# Altium schematic sheet Main.SchDoc
size A2; ApprovedBy: Mateusz Kowalik; CheckedBy: Mateusz Kowalik; Author: Mateusz Kowalik; CompanyName: InMotion Labs sp. z o.o.; DrawnBy: Mateusz Kowalik; Engineer: Mateusz Kowalik; Organization: InMotion Labs sp. z o.o.; Address1: Rydlówka 5A; Address2: 30-363 Kraków; Address4: Poland; DocumentNumber: 1; Revision: Rev 0; SheetNumber: 1; SheetTotal: 17
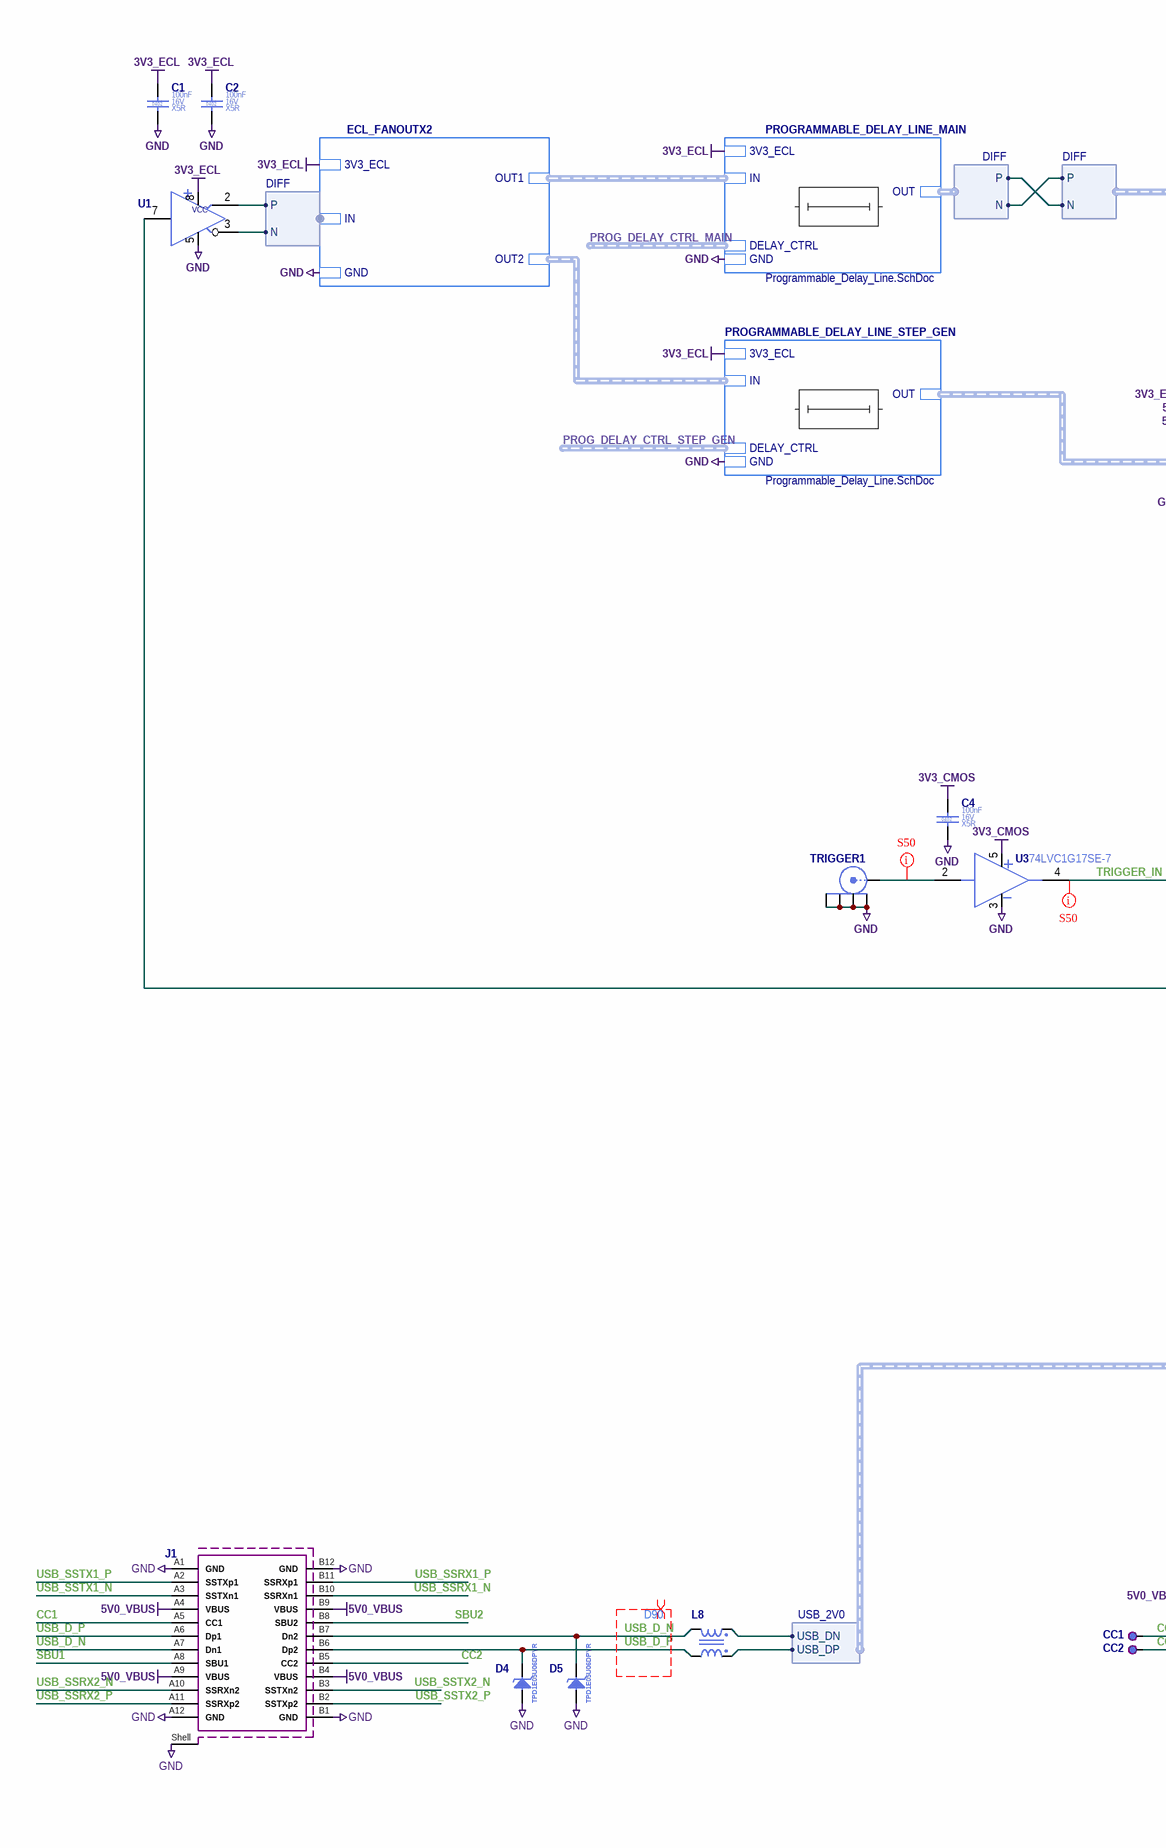
[diagram p0: Main.SchDoc, left]
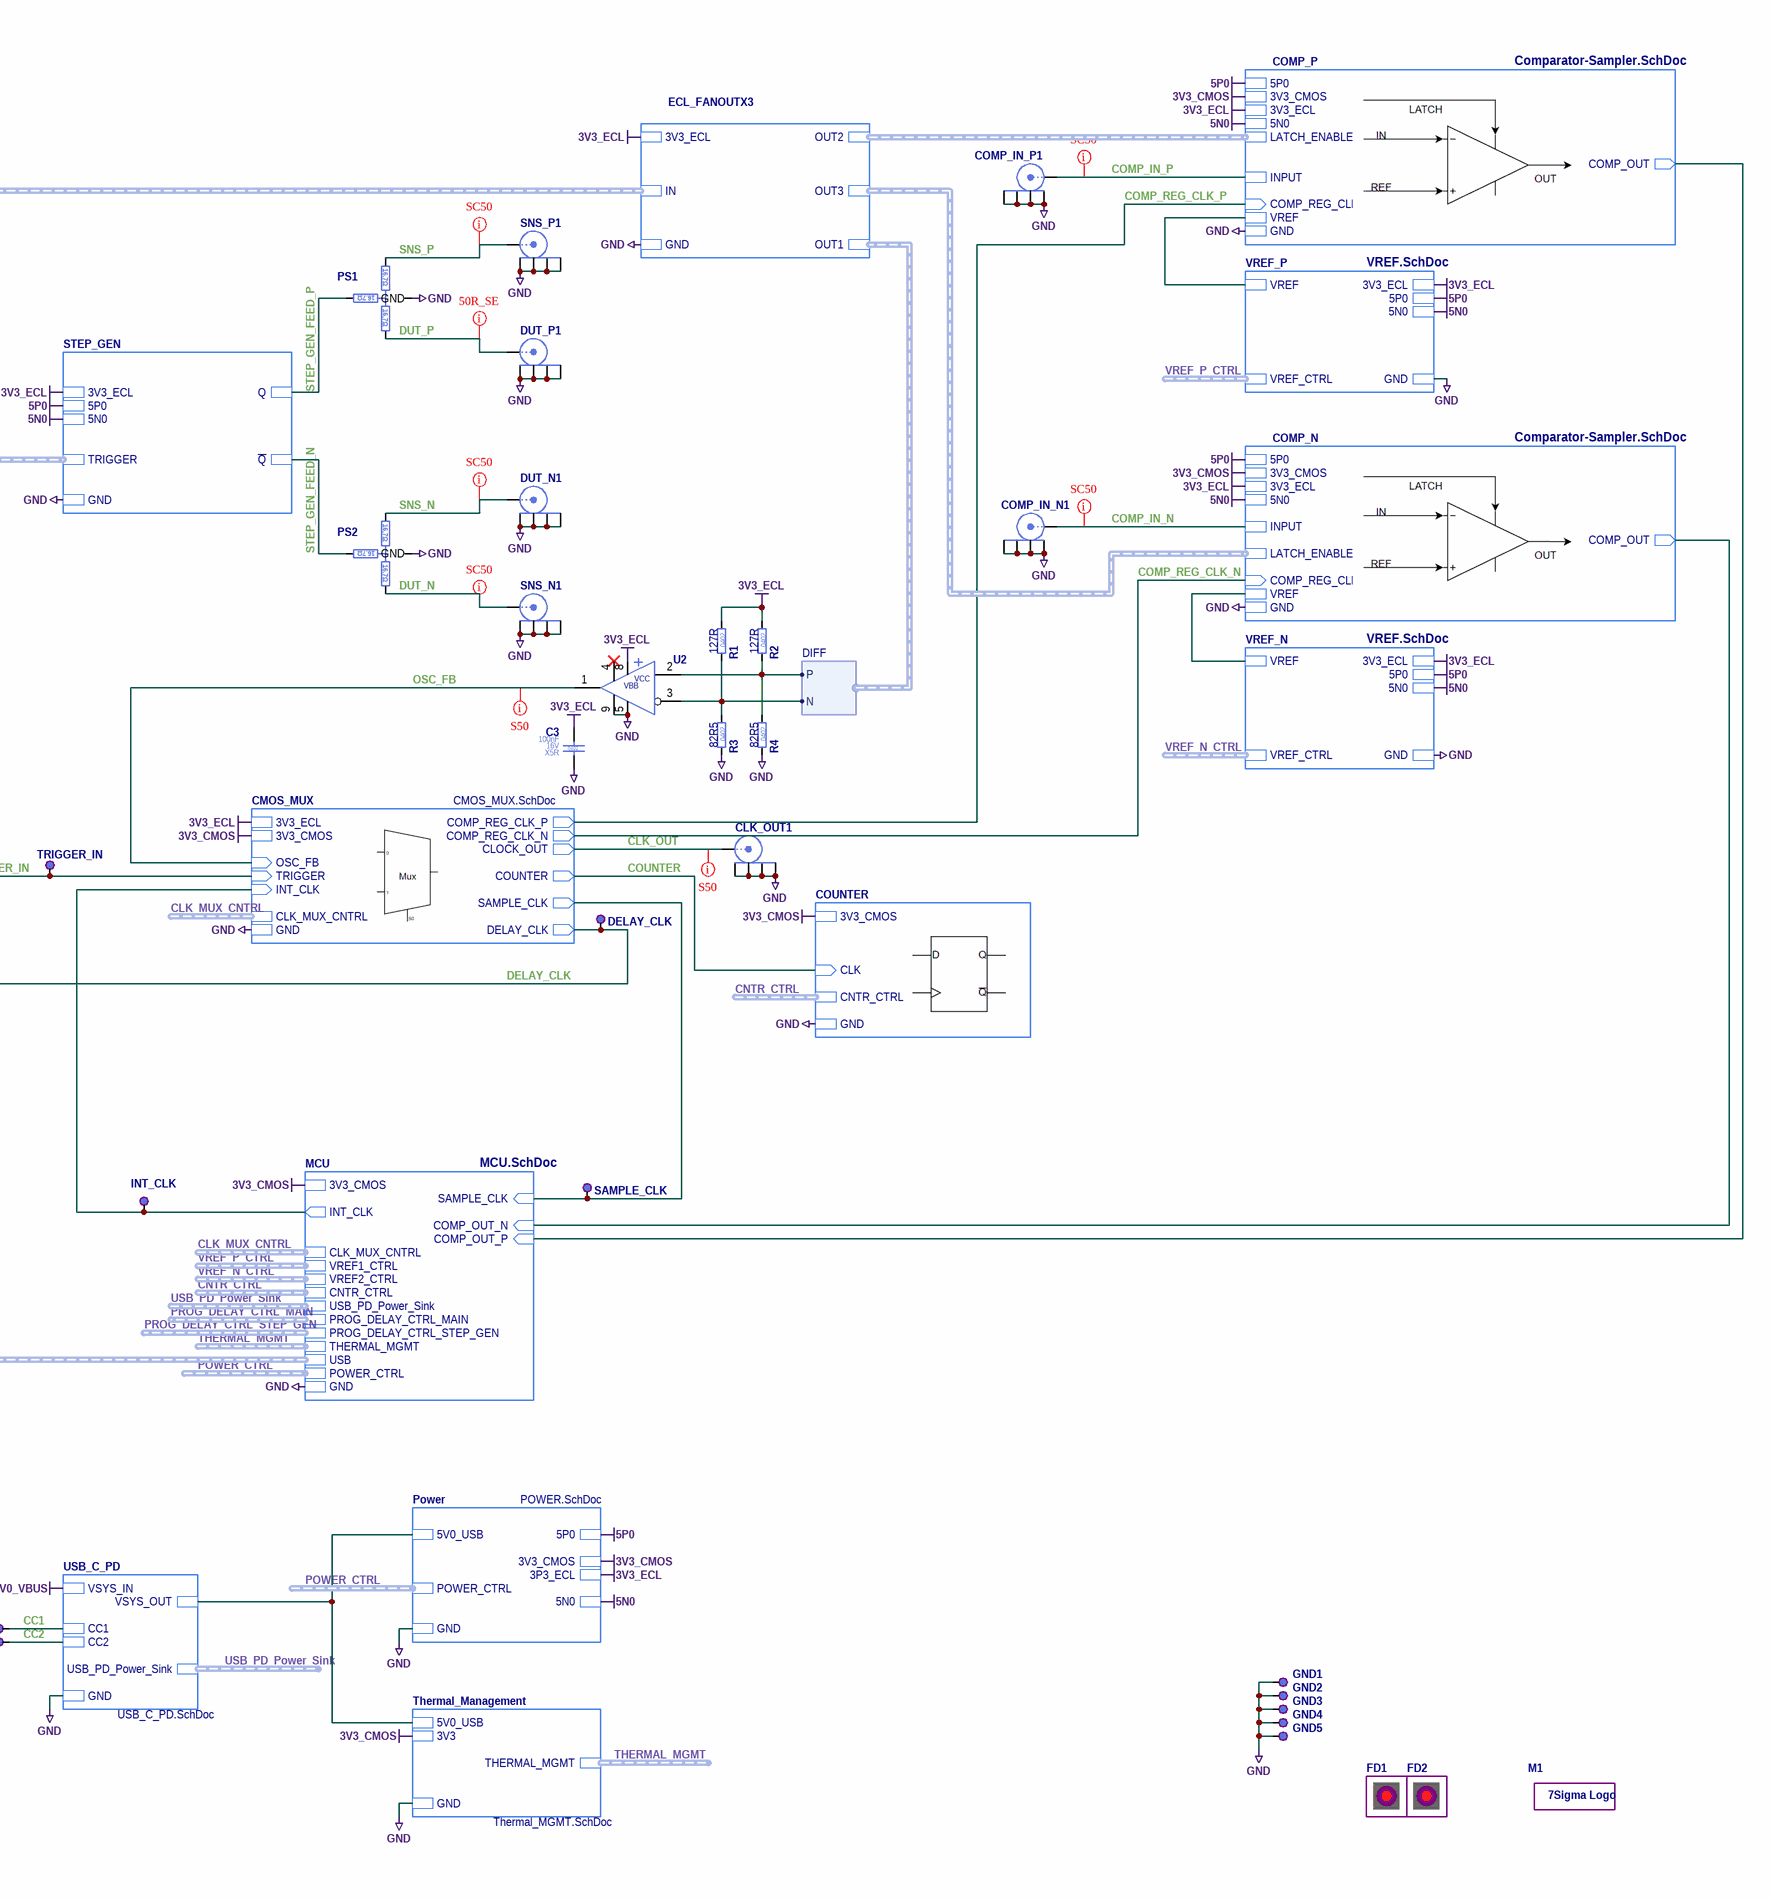
[diagram p1: Main.SchDoc, right]

## Parts
C1  Case/Package: 0402  Voltage Rating (DC): 16V  Dielectric: X5R  Capacitance: 100nF  [C_0402_1005]  (hidden comment: C_100NF_16V_X5R_0402_10)
C2  Case/Package: 0402  Voltage Rating (DC): 16V  Dielectric: X5R  Capacitance: 100nF  [C_0402_1005]  (hidden comment: C_100NF_16V_X5R_0402_10)
C3  Case/Package: 0402  Voltage Rating (DC): 16V  Dielectric: X5R  Capacitance: 100nF  [C_0402_1005]  (hidden comment: C_100NF_16V_X5R_0402_10)
C4  Case/Package: 0402  Voltage Rating (DC): 16V  Dielectric: X5R  Capacitance: 100nF  [C_0402_1005]  (hidden comment: C_100NF_16V_X5R_0402_10)
CC1  TP_PAD_1.3MM  [TP_PAD_1.3MM]  (value not drawn)  (no BOM)
CC2  TP_PAD_1.3MM  [TP_PAD_1.3MM]  (value not drawn)  (no BOM)
CLK_OUT1  60312202111527  [60312202111527]  (value not drawn)
COMP_IN_N1  60312202111527  [60312202111527]  (value not drawn)
COMP_IN_P1  60312202111527  [60312202111527]  (value not drawn)
D4  TPD1E05U06DPYR  [DFN100X60X40-2N]
D5  TPD1E05U06DPYR  [DFN100X60X40-2N]
DELAY_CLK  TP_PAD_1.3MM  [TP_PAD_1.3MM]  (value not drawn)  (no BOM)
DUT_N1  60312202111527  [60312202111527]  (value not drawn)
DUT_P1  60312202111527  [60312202111527]  (value not drawn)
FD1  FIDUCIAL  [FID]  (value not drawn)  (no BOM)
FD2  FIDUCIAL  [FID]  (value not drawn)  (no BOM)
GND1  5016  [5016]  (value not drawn)  (no BOM)
GND2  5016  [5016]  (value not drawn)  (no BOM)
GND3  5016  [5016]  (value not drawn)  (no BOM)
GND4  5016  [5016]  (value not drawn)  (no BOM)
GND5  5016  [5016]  (value not drawn)  (no BOM)
INT_CLK  TP_PAD_1.3MM  [TP_PAD_1.3MM]  (value not drawn)  (no BOM)
J1  632723100011  [632723100011]  (value not drawn)
L8  744231091  [L_0805_COMMON_MODE]  (value not drawn)
M1  7Sigma  [7Sigma]  (value not drawn)  (no BOM)
PS1  PS1608GT2-R50-T1  [PS1608G]  (value not drawn)
PS2  PS1608GT2-R50-T1  [PS1608G]  (value not drawn)
R1  Resistance: 127R  Case/Package: 0402  [R_0402_1005]  (hidden comment: R_127R_0402_1)
R2  Resistance: 127R  Case/Package: 0402  [R_0402_1005]  (hidden comment: R_127R_0402_1)
R3  Resistance: 82R5  Case/Package: 0402  [R_0402_1005]  (hidden comment: R_82R5_0402_1)
R4  Resistance: 82R5  Case/Package: 0402  [R_0402_1005]  (hidden comment: R_82R5_0402_1)
SAMPLE_CLK  TP_PAD_1.3MM  [TP_PAD_1.3MM]  (value not drawn)  (no BOM)
SNS_N1  60312202111527  [60312202111527]  (value not drawn)
SNS_P1  60312202111527  [60312202111527]  (value not drawn)
TRIGGER1  60312202111527  [60312202111527]  (value not drawn)
TRIGGER_IN  TP_PAD_1.3MM  [TP_PAD_1.3MM]  (value not drawn)  (no BOM)
U1  MC100LVELT20DG  [SOIC127P600X170-8N]  (value not drawn)
U2  MC100EPT21MNR4G  [SON50P200X80_HS-9N]  (value not drawn)
U3  74LVC1G17SE-7  [SC70-5_SOT353_TSSOP5]

## Sub-sheets
CMOS_MUX = CMOS_MUX.SchDoc: 3V3_ECL, INT_CLK (in), CLK_MUX_CNTRL (harness CLK_MUX_CTRL), SAMPLE_CLK (out), 3V3_CMOS, CLOCK_OUT (out), GND, OSC_FB (in), DELAY_CLK (out), TRIGGER (in), COMP_REG_CLK_P (out), COUNTER (out), COMP_REG_CLK_N (out)
COMP_N = Comparator-Sampler.SchDoc: INPUT, COMP_OUT (out), VREF, LATCH_ENABLE (harness DIFF), 5N0, 3V3_ECL, GND, 3V3_CMOS, 5P0, COMP_REG_CLK (in)
COMP_P = Comparator-Sampler.SchDoc: INPUT, COMP_OUT (out), VREF, LATCH_ENABLE (harness DIFF), 5N0, 3V3_ECL, GND, 3V3_CMOS, 5P0, COMP_REG_CLK (in)
COUNTER = Counter.SchDoc: CLK (in), GND, CNTR_CTRL (harness CNTR_CTRL), 3V3_CMOS
ECL_FANOUTX2 = ECL_Fanout_X2.SchDoc: GND, 3V3_ECL, IN (harness DIFF), OUT1 (harness DIFF), OUT2 (harness DIFF)
ECL_FANOUTX3 = ECL_Fanout_X3.SchDoc: GND, 3V3_ECL, OUT3 (harness DIFF), IN (harness DIFF), OUT1 (harness DIFF), OUT2 (harness DIFF)
MCU = MCU.SchDoc: COMP_OUT_P (in), SAMPLE_CLK (in), INT_CLK (out), 3V3_CMOS, GND, CLK_MUX_CNTRL (harness CLK_MUX_CTRL), VREF1_CTRL (harness DAC), CNTR_CTRL, VREF2_CTRL (harness DAC), COMP_OUT_N (in), PROG_DELAY_CTRL_MAIN, PROG_DELAY_CTRL_STEP_GEN, THERMAL_MGMT, USB (harness USB_2V0), POWER_CTRL (harness POWER_CTRL), USB_PD_Power_Sink
Power = POWER.SchDoc: 3P3_ECL, 3V3_CMOS, GND, 5N0, 5V0_USB, 5P0, POWER_CTRL
PROGRAMMABLE_DELAY_LINE_MAIN = Programmable_Delay_Line.SchDoc: DELAY_CTRL (harness DELAY), GND, IN (harness DIFF), 3V3_ECL, OUT (harness DIFF)
PROGRAMMABLE_DELAY_LINE_STEP_GEN = Programmable_Delay_Line.SchDoc: DELAY_CTRL (harness DELAY), GND, IN (harness DIFF), 3V3_ECL, OUT (harness DIFF)
STEP_GEN = Step_Gen.SchDoc: GND, 3V3_ECL, TRIGGER (harness DIFF), 5N0, 5P0, ~{Q}, Q
Thermal_Management = Thermal_MGMT.SchDoc: 5V0_USB, GND, 3V3, THERMAL_MGMT (harness THERMAL_MGMT)
USB_C_PD = USB_C_PD.SchDoc: CC2, VSYS_OUT, VSYS_IN, GND, CC1, USB_PD_Power_Sink (harness USB_PD_Power_Sink)
VREF_N = VREF.SchDoc: VREF_CTRL (harness DAC), VREF, 3V3_ECL, 5N0, GND, 5P0
VREF_P = VREF.SchDoc: VREF_CTRL (harness DAC), VREF, 3V3_ECL, 5N0, GND, 5P0

## Harnesses
DIFF: P, N
USB_2V0: USB_DN, USB_DP

## Nets
3V3_CMOS: C4.1 U3.5(VCC) ; sheet COMP_P/3V3_CMOS, sheet MCU/3V3_CMOS, sheet Power/3V3_CMOS, sheet CMOS_MUX/3V3_CMOS, sheet COUNTER/3V3_CMOS, sheet Thermal_Management/3V3, sheet COMP_N/3V3_CMOS
3V3_ECL: C1.1 C2.1 C3.1 R1.2 R2.2 U1.8(VCC) U2.8(VDD) ; sheet VREF_P/3V3_ECL, sheet COMP_P/3V3_ECL, sheet Power/3P3_ECL, sheet PROGRAMMABLE_DELAY_LINE_MAIN/3V3_ECL, sheet ECL_FANOUTX3/3V3_ECL, sheet STEP_GEN/3V3_ECL, sheet CMOS_MUX/3V3_ECL, sheet VREF_N/3V3_ECL, sheet COMP_N/3V3_ECL, sheet ECL_FANOUTX2/3V3_ECL, sheet PROGRAMMABLE_DELAY_LINE_STEP_GEN/3V3_ECL
5N0: sheet VREF_P/5N0, sheet COMP_P/5N0, sheet Power/5N0, sheet STEP_GEN/5N0, sheet VREF_N/5N0, sheet COMP_N/5N0
5P0: sheet VREF_P/5P0, sheet COMP_P/5P0, sheet Power/5P0, sheet STEP_GEN/5P0, sheet VREF_N/5P0, sheet COMP_N/5P0
5V0_VBUS: J1.A4(VBUS) J1.A9(VBUS) J1.B4(VBUS) J1.B9(VBUS) ; sheet USB_C_PD/VSYS_IN
GND: C1.2 C2.2 C3.2 C4.2 CLK_OUT1.2(Y) CLK_OUT1.3(Y) CLK_OUT1.4(Y) CLK_OUT1.5(Y) COMP_IN_N1.2(Y) COMP_IN_N1.3(Y) COMP_IN_N1.4(Y) COMP_IN_N1.5(Y) COMP_IN_P1.2(Y) COMP_IN_P1.3(Y) COMP_IN_P1.4(Y) COMP_IN_P1.5(Y) D4.2(A) D5.2(A) DUT_N1.2(Y) DUT_N1.3(Y) DUT_N1.4(Y) DUT_N1.5(Y) DUT_P1.2(Y) DUT_P1.3(Y) DUT_P1.4(Y) DUT_P1.5(Y) GND1.1(TP) GND2.1(TP) GND3.1(TP) GND4.1(TP) GND5.1(TP) J1.A1(GND) J1.A12(GND) J1.B1(GND) J1.B12(GND) J1.Shell(Shield) PS1.4(GND) PS2.4(GND) R3.1 R4.1 SNS_N1.2(Y) SNS_N1.3(Y) SNS_N1.4(Y) SNS_N1.5(Y) SNS_P1.2(Y) SNS_P1.3(Y) SNS_P1.4(Y) SNS_P1.5(Y) TRIGGER1.2(Y) TRIGGER1.3(Y) TRIGGER1.4(Y) TRIGGER1.5(Y) U1.5(VSS) U2.5(VSS) U2.9(VSS) U3.3(GND) ; sheet VREF_P/GND, sheet COMP_P/GND, sheet MCU/GND, sheet Power/GND, sheet PROGRAMMABLE_DELAY_LINE_MAIN/GND, sheet ECL_FANOUTX3/GND, sheet STEP_GEN/GND, sheet CMOS_MUX/GND, sheet COUNTER/GND, sheet Thermal_Management/GND, sheet VREF_N/GND, sheet COMP_N/GND, sheet ECL_FANOUTX2/GND, sheet PROGRAMMABLE_DELAY_LINE_STEP_GEN/GND, sheet USB_C_PD/GND
CC1: CC1.1(TP) J1.A5(CC1) ; sheet USB_C_PD/CC1
CC2: CC2.1(TP) J1.B5(CC2) ; sheet USB_C_PD/CC2
CLK_OUT: CLK_OUT1.1(X) ; sheet CMOS_MUX/CLOCK_OUT
COMP_IN_N: COMP_IN_N1.1(X) ; sheet COMP_N/INPUT
COMP_IN_P: COMP_IN_P1.1(X) ; sheet COMP_P/INPUT
COMP_REG_CLK_N: sheet CMOS_MUX/COMP_REG_CLK_N, sheet COMP_N/COMP_REG_CLK
COMP_REG_CLK_P: sheet COMP_P/COMP_REG_CLK, sheet CMOS_MUX/COMP_REG_CLK_P
COUNTER: sheet CMOS_MUX/COUNTER, sheet COUNTER/CLK
DELAY_CLK: DELAY_CLK.1(TP) U1.7(D) ; sheet CMOS_MUX/DELAY_CLK
DUT_N: PS2.3(OUT2) SNS_N1.1(X)
DUT_P: DUT_P1.1(X) PS1.3(OUT2)
OSC_FB: U2.1(OUTA) ; sheet CMOS_MUX/OSC_FB
SBU1: J1.A8(SBU1)
SBU2: J1.B8(SBU2)
SNS_N: DUT_N1.1(X) PS2.2(OUT1)
SNS_P: PS1.2(OUT1) SNS_P1.1(X)
STEP_GEN_FEED_N: PS2.1(IN) ; sheet STEP_GEN/~{Q}
STEP_GEN_FEED_P: PS1.1(IN) ; sheet STEP_GEN/Q
TRIGGER_IN: TRIGGER_IN.1(TP) U3.4(Y) ; sheet CMOS_MUX/TRIGGER
USB_D_N: D5.1(C) J1.A7(Dn1) J1.B7(Dn2) L8.2
USB_D_P: D4.1(C) J1.A6(Dp1) J1.B6(Dp2) L8.3
USB_SSRX1_N: J1.B10(SSRXn1)
USB_SSRX1_P: J1.B11(SSRXp1)
USB_SSRX2_N: J1.A10(SSRXn2)
USB_SSRX2_P: J1.A11(SSRXp2)
USB_SSTX1_N: J1.A3(SSTXn1)
USB_SSTX1_P: J1.A2(SSTXp1)
USB_SSTX2_N: J1.B3(SSTXn2)
USB_SSTX2_P: J1.B2(SSTXp2)
NetINT_CLK_1: INT_CLK.1(TP) ; sheet MCU/INT_CLK, sheet CMOS_MUX/INT_CLK
NetL8_1: L8.1 ; sheet MCU/USB.USB_DN
NetL8_4: L8.4 ; sheet MCU/USB.USB_DP
NetR1_1: R1.1 R3.2 U2.3(~{D}) ; sheet ECL_FANOUTX3/OUT1.N
NetR2_1: R2.1 R4.2 U2.2(D) ; sheet ECL_FANOUTX3/OUT1.P
NetSAMPLE_CLK_1: SAMPLE_CLK.1(TP) ; sheet MCU/SAMPLE_CLK, sheet CMOS_MUX/SAMPLE_CLK
NetTRIGGER1_1: TRIGGER1.1(X) U3.2(A)
NetU1_2: U1.2(Q) ; sheet ECL_FANOUTX2/IN.P
NetU1_3: U1.3(~{Q}) ; sheet ECL_FANOUTX2/IN.N
(unnamed): sheet VREF_P/VREF, sheet COMP_P/VREF
(unnamed): sheet COMP_P/COMP_OUT, sheet MCU/COMP_OUT_P
(unnamed): sheet MCU/COMP_OUT_N, sheet COMP_N/COMP_OUT
(unnamed): sheet Power/5V0_USB, sheet Thermal_Management/5V0_USB, sheet USB_C_PD/VSYS_OUT
(unnamed): sheet VREF_N/VREF, sheet COMP_N/VREF
(unnamed): sheet PROGRAMMABLE_DELAY_LINE_MAIN/OUT.P, sheet ECL_FANOUTX3/IN.N
(unnamed): sheet PROGRAMMABLE_DELAY_LINE_MAIN/OUT.N, sheet ECL_FANOUTX3/IN.P

Not connected (* = marked no-connect by the designer): U1 1(NC) 4(NC) 6(NC); U2 4(VDD)*

## Buses and harness runs
harness CLK_MUX_CNTRL = sheet CMOS_MUX/CLK_MUX_CNTRL
harness CLK_MUX_CNTRL = sheet MCU/CLK_MUX_CNTRL
harness CNTR_CTRL = sheet COUNTER/CNTR_CTRL
harness CNTR_CTRL = sheet MCU/CNTR_CTRL
harness POWER_CTRL = sheet MCU/POWER_CTRL
harness POWER_CTRL = sheet Power/POWER_CTRL
harness PROG_DELAY_CTRL_MAIN = sheet MCU/PROG_DELAY_CTRL_MAIN
harness PROG_DELAY_CTRL_MAIN = sheet PROGRAMMABLE_DELAY_LINE_MAIN/DELAY_CTRL
harness PROG_DELAY_CTRL_STEP_GEN = sheet MCU/PROG_DELAY_CTRL_STEP_GEN
harness PROG_DELAY_CTRL_STEP_GEN = sheet PROGRAMMABLE_DELAY_LINE_STEP_GEN/DELAY_CTRL
harness sheet COMP_N/LATCH_ENABLE = sheet ECL_FANOUTX3/OUT3
harness sheet COMP_P/LATCH_ENABLE = sheet ECL_FANOUTX3/OUT2
harness sheet ECL_FANOUTX2/OUT1 = sheet PROGRAMMABLE_DELAY_LINE_MAIN/IN
harness sheet ECL_FANOUTX2/OUT2 = sheet PROGRAMMABLE_DELAY_LINE_STEP_GEN/IN
harness sheet PROGRAMMABLE_DELAY_LINE_STEP_GEN/OUT = sheet STEP_GEN/TRIGGER
harness THERMAL_MGMT = sheet MCU/THERMAL_MGMT
harness THERMAL_MGMT = sheet Thermal_Management/THERMAL_MGMT
harness USB_PD_Power_Sink = sheet MCU/USB_PD_Power_Sink
harness USB_PD_Power_Sink = sheet USB_C_PD/USB_PD_Power_Sink
harness VREF_N_CTRL = sheet MCU/VREF2_CTRL
harness VREF_N_CTRL = sheet VREF_N/VREF_CTRL
harness VREF_P_CTRL = sheet MCU/VREF1_CTRL
harness VREF_P_CTRL = sheet VREF_P/VREF_CTRL

## Layout directives
net class SC50: DUT_N, DUT_P, SNS_N, SNS_P
net class S50: CLK_OUT, NetTRIGGER1_1, OSC_FB, TRIGGER_IN
net class SC50; net class COMP_IN: COMP_IN_N, COMP_IN_P
differential pair; differential pair class D90: USB_D_N, USB_D_P

## Notes on the sheet
- Title
- Size:
- Date:
- A2
- (in symbol 7Sigma) 7Sigma Logo
- (in symbol MC100EPT21MNR4G) VCC; VBB
- (in symbol PS1608GT2-R50-T1) 16.7Ω

## Library data of the parts
C1-C4 = C_100NF_16V_X5R_0402_10: Ceramic Capacitor; Manufacturer Part Number: EMK105BJ104KV-F; Manufacturer: Taiyo Yuden; Value: 100nF; Tolerance: 10%; Part Number: C_100NF_16V_X5R_0402_10; Mount: Surface Mount; Height: 500um; HelpURL: http://datasheet.octopart.com/EMK105BJ104KV-F-Taiyo-Yuden-datasheet-8857305.pdf; RoHS: Compliant; Max Operating Temperature: 125°C; Status: MK; Supplier 1: Mouser; Supplier Part Number 1: 963-EMK105BJ104KV-F; Manufacturer 2: Samsung Electro-Mechanics; Manufacturer Part Number 2: CL05B104KO5NNNC; Supplier 2: LCSC; Supplier Part Number 2: C1525
CC1 CC2 DELAY_CLK INT_CLK SAMPLE_CLK TRIGGER_IN = TP_PAD_1.3MM: Testpoint SMD 1.3mm; Part Number: TP_PAD_1.3MM; Case/Package: SMD; Length: 0mm
CLK_OUT1 COMP_IN_N1 COMP_IN_P1 DUT_N1 DUT_P1 SNS_N1 SNS_P1 TRIGGER1 = 60312202111527: SMA Connector; Manufacturer: Wurth Electronics; Gender: Female; Max Frequency: 18GHz; Box: T1; Manufacturer Part Number: 60312202111527; Part Number: 60312202111527; Mount: SMD; Height: 6.35mm; HelpURL: https://www.we-online.com/catalog/datasheet/60312202111527.pdf; Lead Free: Lead Free; Length: 13.33mm; Number of Pins: 3; Orientation: Vertical; RoHS: Compliant; Stock: 3
D4 D5 = TPD1E05U06DPYR: 1 Channel ESD Protection Device for Super-Speed (Up to 6 Gbps); Manufacturer: Texas Instruments; Capacitance: 0.5pF; Max Power Dissipation: 40W; Direction: Unidirectional; Max Breakdown Voltage: 5.5V; Min Breakdown Voltage: 6V; Box: 79; Part Number: TPD1E05U06DPYR; Case/Package: 0402; Manufacturer Part Number: TPD1E05U06DPYR; Mount: Surface Mount; HelpURL: https://www.ti.com/lit/ds/symlink/tpd1e05u06.pdf?ts=1594570399510&ref_url=https%253A%252F%252Fwww.ti.com%252Fproduct%252FTPD1E05U06; Working Voltage: 5.5V; Max Operating Temperature: 125°C; RoHS: Compliant; Height: 0.35mm; Status: MK; Supplier 1: Mouser; Supplier Part Number 1: 595-TPD1E05U06DPYR; Stock: 56
GND1-GND5 = 5016: Test Point; Micro Mini; SMT; Phos Bronze/Silver; Manufacturer: Keystone Electronics; Number of Ports: 1; Part Number: 5016; Case/Package: SMD; Mount: Surface Mount; Height: 0.09inch; HelpURL: https://pl.mouser.com/datasheet/2/215/016-743689.pdf; Lead Free: Lead Free; Length: 3.81mm; Number of Pins: 1; REACH SVHC: No SVHC; RoHS: Compliant; Termination: Solder; Manufacturer Part Number: 5016; Supplier 1: Mouser; Supplier Part Number 1: 534-5016
J1 = 632723100011: WR-COM USB 3.1 Type C Receptacle Horizontal THT / SMT; Manufacturer: Wurth Electronics; Box: G5; Part Number: 632723100011; Manufacturer Part Number: 632723100011; Mount: Surface Mount,Through Hole; Number of Pins: 24; Orientation: Horizontal; HelpURL: https://pl.mouser.com/datasheet/2/445/632723x00011(3)-782157.pdf; Max Operating Temperature: 105C; RoHS: Compilant; Stock: 13
L8 = 744231091: Common Mode Line Filter; Manufacturer: Wurth Elektronik; Inductance: 131nH; DC Current: 370mA; DC Resistance: 300m; Box: 72; Part Number: 744231091; Manufacturer Part Number: 744231091; Case/Package: 0805; Mount: Surface Mount; Height: 1.2mm; HelpURL: https://www.we-online.com/catalog/datasheet/744231091.pdf; Max Operating Temperature: 125; Status: MK; RoHS: Compliant; Stock: 22
M1 = 7Sigma: 7Sigma Marking; Part Number: 7Sigma; Status: MK
PS1 PS2 = PS1608GT2-R50-T1: 20GHz Resistive Power Splitter; Manufacturer: Susumu; Impedance: 50Ohm; Manufacturer Part Number: PS1608GT2-R50-T1; Part Number: PS1608GT2-R50-T1; Mount: Surface Mount; Frequency: 20GHz; Height: 400um; HelpURL: https://pl.mouser.com/datasheet/2/392/n_catalog_partition31_en-1660522.pdf; Max Operating Temperature: 125; Min Operating Temperature: -40; Status: MK; RoHS: Compliant
R1 R2 = R_127R_0402_1: Thick Film Resistor; Manufacturer: Yageo; Manufacturer Part Number: RC0402FR-07127RL; Value: 127R; Tolerance: 1%; Voltage Rating (DC): 50V; Power Rating: 63mW; Stats: MK; Part Number: R_127R_0402_1; Mount: Surface Mount; Height: 350um; HelpURL: https://pl.mouser.com/datasheet/2/447/PYu_RC_Group_51_RoHS_L_10-1664068.pdf; RoHS: Compliant; Max Operating Temperature: 155°C; Supplier 1: Mouser; Supplier Part Number 1: 603-RC0402FR-07127RL; Manufacturer 2: Uniroyal Elec; Manufacturer Part Number 2: 0402WGF1270TCE; Supplier 2: LCSC; Supplier Part Number 2: C247127
R3 R4 = R_82R5_0402_1: Thick Film Resistor; Manufacturer: Yageo; Manufacturer Part Number: RC0402FR-0782R5L; Value: 82R5; Tolerance: 1%; Voltage Rating (DC): 50V; Power Rating: 63mW; Stats: MK; Part Number: R_82R5_0402_1; Mount: Surface Mount; Height: 350um; HelpURL: https://pl.mouser.com/datasheet/2/447/PYu-RC_Group_51_RoHS_L_10-1527934.pdf; RoHS: Compliant; Max Operating Temperature: 155°C; Supplier 1: Mouser; Supplier Part Number 1: 603-RC0402FR-0782R5L; Manufacturer 2: Uniroyal Elec; Manufacturer Part Number 2: 0402WGF825JTCE; Supplier 2: LCSC; Supplier Part Number 2: C52037
U1 = MC100LVELT20DG: LVTTL/LVCMOS to Differential LVPECL Translator; Manufacturer: ON Semiconductor; Output Current: 100mA; Marking: KVT20; Max Supply Voltage: 3.6V; Min Supply Voltage: 3V; Part Number: MC100LVELT20DG; Case/Package: SOIC8; Max Output Current: 100mA; Mount: Surface Mount; Height: 1.75mm; HelpURL: https://pl.mouser.com/datasheet/2/308/MC100LVELT20_D-1811115.pdf; Max Operating Temperature: 85°C; RoHS: Compliant; Status: MK; Manufacturer Part Number: MC100LVELT20DG; Supplier 1: Mouser; Supplier Part Number 1: 863-MC100LVELT20DG
U2 = MC100EPT21MNR4G: Differential LVPECL/LVDS/CML to LVTTL/LVCMOS Translator; Manufacturer: ON Semiconductor; Output Current: 24mA; Marking: 3RM; Max Supply Voltage: 3.8V; Min Supply Voltage: 3.3V; Part Number: MC100EPT21MNR4G; Case/Package: DFN-8; Max Output Current: 24mA; Mount: Surface Mount; Height: 1mm; HelpURL: https://datasheet.octopart.com/MC100EPT21MNR4G-ON-Semiconductor-datasheet-12520234.pdf; Max Operating Temperature: 85°C; RoHS: Compliant; Status: MK; Manufacturer Part Number: MC100EPT21MNR4G; Supplier 1: Mouser; Supplier Part Number 1: 863-MC100EPT21MNR4G
U3 = 74LVC1G17SE-7: Schmitt Buffer; Manufacturer: Diodes Incorporated; Output Current: 24mA; Marking: UR; Max Supply Voltage: 5.5V; Min Supply Voltage: 1.65V; Manufacturer Part Number: 74LVC1G17SE-7; Part Number: 74LVC1G17SE-7; Case/Package: SOT-353; Max Output Current: 24mA; Mount: Surface Mount; HelpURL: https://datasheet.octopart.com/74LVC1G17SE-7-Diodes-Inc.-datasheet-46750521.pdf; Max Operating Temperature: 125°C; RoHS: Compliant; Status: MK; Supplier 1: Mouser; Supplier Part Number 1: 621-74LVC1G17SE-7
FD1 FD2 = FIDUCIAL: Part Number: FIDUCIAL; Status: MK